# Altium project BreakoutMS5837.PrjPcb
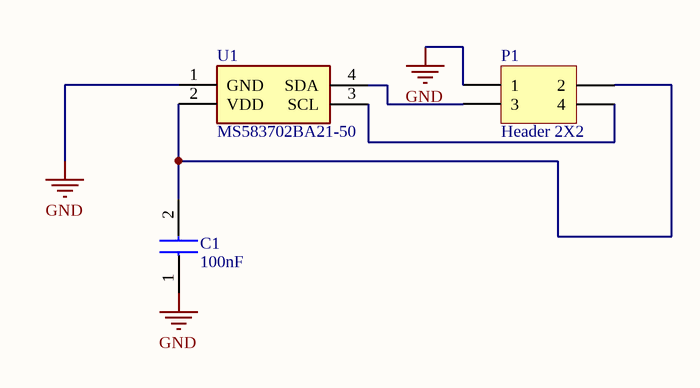
[diagram p0: SheetMS5837.SchDoc]
1 sheet, 3 parts. Net scope: global (net labels, ports and power ports of the same name join across sheets).
Board file: PCB.PcbDoc

## Sheet SheetMS5837.SchDoc
size A4; SheetNumber: 1; SheetTotal: 1

### Parts
C1  100nF  [CAPC2012X94N]
P1  Header 2X2  [HDR2X2]
U1  MS583702BA21-50  [MS583702BA0150]

### Nets
GND: C1.1 P1.1 U1.1(GND)
NetC1_2: C1.2 P1.2 U1.2(VDD)
NetP1_3: P1.3 U1.4(SDA)
NetP1_4: P1.4 U1.3(SCL)

### Library data of the parts
C1 = 08055A130JAT2A: Capacitor; Manufacturer_Name: AVX; Datasheet Link: https://componentsearchengine.com/Datasheets/1/06031A100FAT2A.pdf; Height: 0.94mm; Manufacturer_Part_Number: 08055A130JAT2A; Mouser Part Number: 581-08055A130JAT2A; Mouser Price/Stock: https://www.mouser.com/Search/Refine.aspx?Keyword=581-08055A130JAT2A
P1 = Header 2X2: Header, 2-Pin, Dual row; LatestRevisionDate: 17-Jul-2002; LatestRevisionNote: Re-released for DXP Platform.; Publisher: Altium Limited
U1 = MS583702BA21-50: Undefined or Miscellaneous; Manufacturer_Name: TE Connectivity; Datasheet Link: http://www.farnell.com/datasheets/2646146.pdf; Height: 2.75mm; Manufacturer_Part_Number: MS583702BA21-50; Mouser Part Number: 824-MS583702BA21-50; Mouser Price/Stock: https://www.mouser.co.uk/ProductDetail/Measurement-Specialties/MS583702BA21-50/?qs=wd5RIQLrsJg6rRsxw5mX6w%3D%3D; Arrow Part Number: MS583702BA21-50; Arrow Price/Stock: https://www.arrow.com/en/products/ms583702ba21-50/te-connectivity